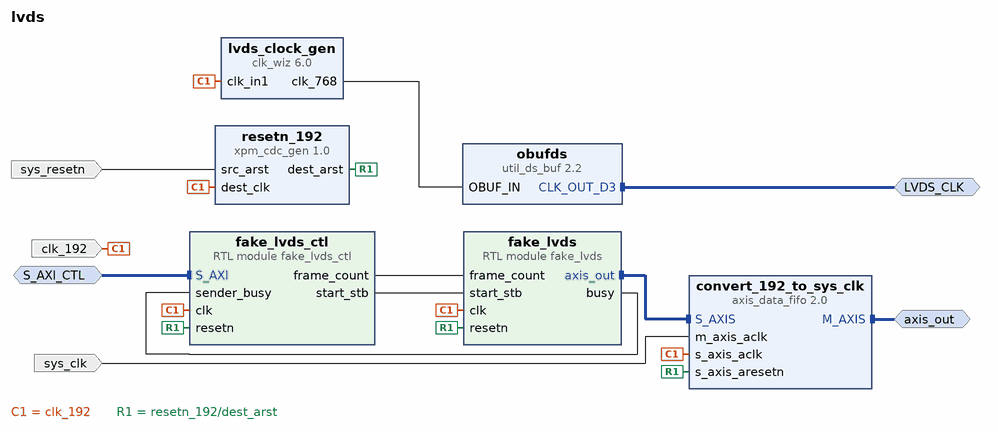
[diagram p0: block diagram of the top level]
# Vivado block design lvds, xcku15p-ffve1517-3-e, Vivado 2024.2
create_bd_design lvds

create_bd_intf_port -mode Master -vlnv xilinx.com:interface:diff_clock_rtl:1.0 LVDS_CLK
create_bd_intf_port -mode Master -vlnv xilinx.com:interface:axis_rtl:1.0 axis_out
set_property -dict {CONFIG.CLK_DOMAIN top_level_xdma_0_0_axi_aclk CONFIG.FREQ_HZ 250000000} [get_bd_intf_ports axis_out]
create_bd_intf_port -mode Slave -vlnv xilinx.com:interface:aximm_rtl:1.0 S_AXI_CTL
set_property -dict [list \
  CONFIG.ADDR_WIDTH 16 \
  CONFIG.ARUSER_WIDTH 0 \
  CONFIG.AWUSER_WIDTH 0 \
  CONFIG.BUSER_WIDTH 0 \
  CONFIG.CLK_DOMAIN lvds_clk_192 \
  CONFIG.DATA_WIDTH 32 \
  CONFIG.FREQ_HZ 192000000 \
  CONFIG.HAS_BRESP 1 \
  CONFIG.HAS_BURST 0 \
  CONFIG.HAS_CACHE 0 \
  CONFIG.HAS_LOCK 0 \
  CONFIG.HAS_PROT 1 \
  CONFIG.HAS_QOS 0 \
  CONFIG.HAS_REGION 0 \
  CONFIG.HAS_RRESP 1 \
  CONFIG.HAS_WSTRB 1 \
  CONFIG.ID_WIDTH 0 \
  CONFIG.NUM_READ_OUTSTANDING 1 \
  CONFIG.NUM_READ_THREADS 1 \
  CONFIG.NUM_WRITE_OUTSTANDING 1 \
  CONFIG.NUM_WRITE_THREADS 1 \
  CONFIG.PROTOCOL AXI4LITE \
  CONFIG.READ_WRITE_MODE READ_WRITE \
  CONFIG.RUSER_BITS_PER_BYTE 0 \
  CONFIG.RUSER_WIDTH 0 \
  CONFIG.WUSER_BITS_PER_BYTE 0 \
  CONFIG.WUSER_WIDTH 0 \
] [get_bd_intf_ports S_AXI_CTL]
create_bd_port -dir I sys_resetn
create_bd_port -dir I -type clk sys_clk
set_property -dict [list \
  CONFIG.ASSOCIATED_BUSIF axis_out \
  CONFIG.CLK_DOMAIN top_level_xdma_0_0_axi_aclk \
  CONFIG.FREQ_HZ 250000000 \
] [get_bd_ports sys_clk]
create_bd_port -dir I -type clk clk_192
set_property -dict [list \
  CONFIG.ASSOCIATED_BUSIF S_AXI_CTL \
  CONFIG.CLK_DOMAIN lvds_clk_192 \
  CONFIG.FREQ_HZ 192000000 \
] [get_bd_ports clk_192]

create_bd_cell -type ip -vlnv xilinx.com:ip:axis_data_fifo:2.0 convert_192_to_sys_clk
set_property -dict {CONFIG.FIFO_DEPTH 16 CONFIG.IS_ACLK_ASYNC 1} [get_bd_cells convert_192_to_sys_clk]
create_bd_cell -type module -reference fake_lvds_ctl fake_lvds_ctl
create_bd_cell -type ip -vlnv xilinx.com:ip:clk_wiz:6.0 lvds_clock_gen
set_property -dict [list \
  CONFIG.CLKOUT1_JITTER 64.075 \
  CONFIG.CLKOUT1_PHASE_ERROR 72.940 \
  CONFIG.CLKOUT1_REQUESTED_OUT_FREQ 768 \
  CONFIG.CLK_OUT1_PORT clk_768 \
  CONFIG.MMCM_CLKFBOUT_MULT_F 8.000 \
  CONFIG.MMCM_CLKOUT0_DIVIDE_F 2.000 \
  CONFIG.MMCM_DIVCLK_DIVIDE 1 \
  CONFIG.PRIM_SOURCE Global_buffer \
  CONFIG.USE_LOCKED false \
  CONFIG.USE_RESET false \
] [get_bd_cells lvds_clock_gen]
create_bd_cell -type ip -vlnv xilinx.com:ip:xpm_cdc_gen:1.0 resetn_192
set_property -dict {CONFIG.CDC_TYPE xpm_cdc_async_rst} [get_bd_cells resetn_192]
create_bd_cell -type ip -vlnv xilinx.com:ip:util_ds_buf:2.2 obufds
set_property -dict {CONFIG.C_BUF_TYPE OBUFDS} [get_bd_cells obufds]
create_bd_cell -type module -reference fake_lvds fake_lvds

# ---- connections ----

connect_bd_intf_net [get_bd_intf_pins fake_lvds_ctl/S_AXI] [get_bd_intf_ports S_AXI_CTL]
connect_bd_intf_net [get_bd_intf_pins convert_192_to_sys_clk/M_AXIS] [get_bd_intf_ports axis_out]
connect_bd_intf_net -intf_net fake_lvds_0_axis_out [get_bd_intf_pins fake_lvds/axis_out] [get_bd_intf_pins convert_192_to_sys_clk/S_AXIS]
connect_bd_intf_net [get_bd_intf_pins obufds/CLK_OUT_D3] [get_bd_intf_ports LVDS_CLK]
connect_bd_net -net clk_192_1 [get_bd_ports clk_192] \
  [get_bd_pins convert_192_to_sys_clk/s_axis_aclk] [get_bd_pins resetn_192/dest_clk] [get_bd_pins lvds_clock_gen/clk_in1] \
  [get_bd_pins fake_lvds/clk] [get_bd_pins fake_lvds_ctl/clk]
connect_bd_net -net fake_lvds_0_busy [get_bd_pins fake_lvds/busy] [get_bd_pins fake_lvds_ctl/sender_busy]
connect_bd_net [get_bd_pins fake_lvds_ctl/frame_count] [get_bd_pins fake_lvds/frame_count]
connect_bd_net [get_bd_pins fake_lvds_ctl/start_stb] [get_bd_pins fake_lvds/start_stb]
connect_bd_net [get_bd_pins lvds_clock_gen/clk_768] [get_bd_pins obufds/OBUF_IN]
connect_bd_net -net m_axis_aclk_1 [get_bd_ports sys_clk] [get_bd_pins convert_192_to_sys_clk/m_axis_aclk]
connect_bd_net -net sync_resetn_dest_arst [get_bd_pins resetn_192/dest_arst] \
  [get_bd_pins convert_192_to_sys_clk/s_axis_aresetn] [get_bd_pins fake_lvds/resetn] [get_bd_pins fake_lvds_ctl/resetn]
connect_bd_net [get_bd_ports sys_resetn] [get_bd_pins resetn_192/src_arst]

# ---- address map ----
assign_bd_address -offset 0x0000 -range 4K -target_address_space [get_bd_addr_spaces S_AXI_CTL] [get_bd_addr_segs fake_lvds_ctl/S_AXI/reg0]

validate_bd_design
save_bd_design
